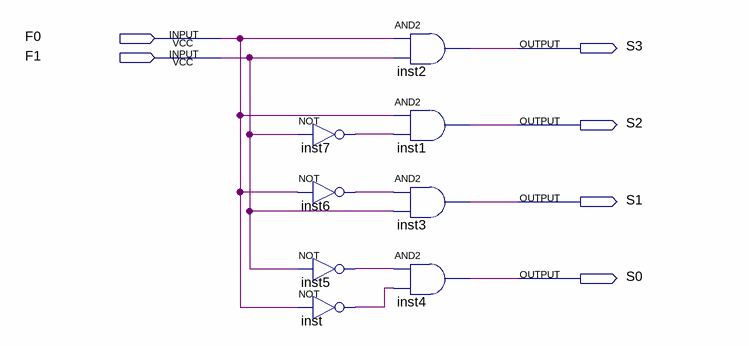
[diagram p0: schematic sheet]
// Quartus schematic decoder_2td4.bdf as structural Verilog: 8 symbols, 6 pins
module decoder_2td4 (
  input  F0,
  input  F1,
  output S3,
  output S2,
  output S1,
  output S0
);

  wire inst5_out, inst6_out, inst7_out, inst_out;

  not inst7 (inst7_out, F1);
  not inst6 (inst6_out, F0);
  not inst5 (inst5_out, F1);
  not inst (inst_out, F0);
  and inst2 (S3, F0, F1);
  and inst1 (S2, F0, inst7_out);
  and inst3 (S1, inst6_out, F1);
  and inst4 (S0, inst5_out, inst_out);
endmodule
